# Altium schematic sheet Connectors and Mechanical.SchDoc: Connectors and Mechanical
size Letter; Date: 2019-01-27; DocumentNumber: 7; Revision: C; SheetNumber: 7; SheetTotal: 7; ProjectTitle: SDRdrum Arty Shield; PageSetup: Record=PageOptions|CenterHorizontal=True|CenterVertical=True|PrintScale=0.98|XCorrection=1.00|YCorrection=1.00|PrintKind=2|BorderSize=5000000|LeftOffset=0|BottomOffset=0|Orientation=2|PaperLength=1000|PaperWidth=1000|Scale=100|PaperSource=7|PrintQuality=-3|MediaType=1|DitherType=10|PrintScaleMode=1|PaperKind=Tabloid|PaperIndex=3
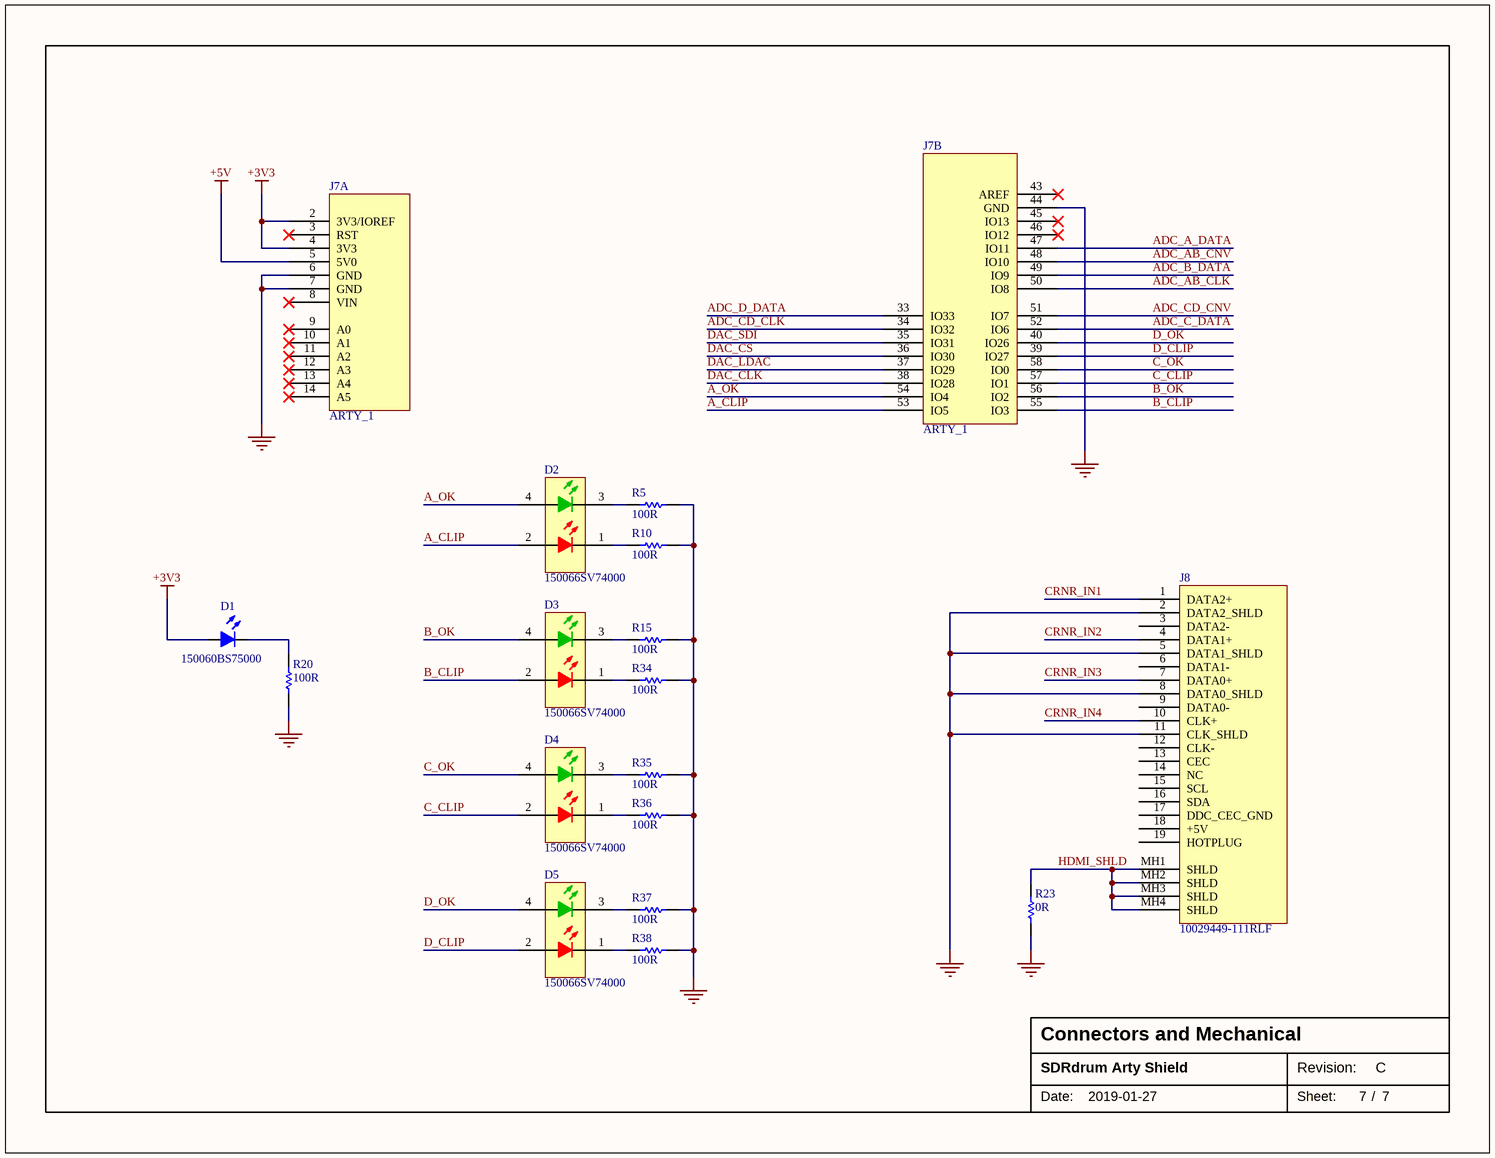
[diagram p0: Connectors and Mechanical.SchDoc]

## Parts
D1  150060BS75000  [WL-SMCW-0603-B]
D2  150066SV74000  [WL-SBCW-0606-GR]
D3  150066SV74000  [WL-SBCW-0606-GR]
D4  150066SV74000  [WL-SBCW-0606-GR]
D5  150066SV74000  [WL-SBCW-0606-GR]
J7  ARTY_1  [ARTY-TH_1]  (parts A,B of 2)
J8  10029449-111RLF  [10029449-111RLF]
R5  value 100R  [RES-0603-M]  (hidden comment: RES 100R 1% 1/10 W 0603 ±100ppm/°C)
R10  value 100R  [RES-0603-M]  (hidden comment: RES 100R 1% 1/10 W 0603 ±100ppm/°C)
R15  value 100R  [RES-0603-M]  (hidden comment: RES 100R 1% 1/10 W 0603 ±100ppm/°C)
R20  value 100R  [RES-0603-M]  (hidden comment: RES 100R 1% 1/10 W 0603 ±100ppm/°C)
R23  value 0R  [RES-0603-M]  (hidden comment: RES 0R Jumper 1/10 W 0603)
R34  value 100R  [RES-0603-M]  (hidden comment: RES 100R 1% 1/10 W 0603 ±100ppm/°C)
R35  value 100R  [RES-0603-M]  (hidden comment: RES 100R 1% 1/10 W 0603 ±100ppm/°C)
R36  value 100R  [RES-0603-M]  (hidden comment: RES 100R 1% 1/10 W 0603 ±100ppm/°C)
R37  value 100R  [RES-0603-M]  (hidden comment: RES 100R 1% 1/10 W 0603 ±100ppm/°C)
R38  value 100R  [RES-0603-M]  (hidden comment: RES 100R 1% 1/10 W 0603 ±100ppm/°C)

## Nets
+3V3: D1.2(A) J7.2(3V3/IOREF) J7.4(3V3)
+5V: J7.5(5V0)
GND: J7.6(GND) J7.7(GND) J7.44(GND) J8.2(DATA2_SHLD) J8.5(DATA1_SHLD) J8.8(DATA0_SHLD) J8.11(CLK_SHLD) R5.1 R10.1 R15.1 R20.1 R23.2 R34.1 R35.1 R36.1 R37.1 R38.1
A_CLIP: D2.2(A) J7.53(IO5)
A_OK: D2.4(A) J7.54(IO4)
ADC_A_DATA: J7.47(IO11)
ADC_AB_CLK: J7.50(IO8)
ADC_AB_CNV: J7.48(IO10)
ADC_B_DATA: J7.49(IO9)
ADC_C_DATA: J7.52(IO6)
ADC_CD_CLK: J7.34(IO32)
ADC_CD_CNV: J7.51(IO7)
ADC_D_DATA: J7.33(IO33)
B_CLIP: D3.2(A) J7.55(IO3)
B_OK: D3.4(A) J7.56(IO2)
C_CLIP: D4.2(A) J7.57(IO1)
C_OK: D4.4(A) J7.58(IO0)
CRNR_IN1: J8.1(DATA2+)
CRNR_IN2: J8.4(DATA1+)
CRNR_IN3: J8.7(DATA0+)
CRNR_IN4: J8.10(CLK+)
D_CLIP: D5.2(A) J7.39(IO27)
D_OK: D5.4(A) J7.40(IO26)
DAC_CLK: J7.38(IO28)
DAC_CS: J7.36(IO30)
DAC_LDAC: J7.37(IO29)
DAC_SDI: J7.35(IO31)
HDMI_SHLD: J8.MH1(SHLD) J8.MH2(SHLD) J8.MH3(SHLD) J8.MH4(SHLD) R23.1
NetD1_1: D1.1(K) R20.2
NetD2_1: D2.1(K) R10.2
NetD2_3: D2.3(K) R5.2
NetD3_1: D3.1(K) R34.2
NetD3_3: D3.3(K) R15.2
NetD4_1: D4.1(K) R36.2
NetD4_3: D4.3(K) R35.2
NetD5_1: D5.1(K) R38.2
NetD5_3: D5.3(K) R37.2

Not connected (* = marked no-connect by the designer): J7 3(RST)* 8(VIN)* 9(A0)* 10(A1)* 11(A2)* 12(A3)* 13(A4)* 14(A5)* 43(AREF)* 45(IO13)* 46(IO12)*; J8 3(DATA2-) 6(DATA1-) 9(DATA0-) 12(CLK-) 13(CEC) 14(NC) 15(SCL) 16(SDA) 17(DDC_CEC_GND) 18(+5V) 19(HOTPLUG)

## Notes on the sheet
- Date:
- Revision:
- Sheet:
- /

## Library data of the parts
D1 = 150060BS75000: LED, Blue (470 nm), 145 mcd, 20 mA, 0805; Supplier 1: Digi-Key; Supplier Part Number 1: 475-1410-1-ND
D2-D5 = 150066SV74000: LED, Green (570 nm)/Red (630 nm), Independent, 30 mcd/55 mcd, 20 mA, 0606
R5 R10 R15 R20 R34-R38 = RC0603FR-07100RL: Manufacturer: Yageo; Manufacturer Series: RC; Power: 1/10 W; Part Number: RC0603FR-07100RL; Component Type: Standard; Tolerance: 1%; Package: 0603; Temperature Coefficient: ±100ppm/°C; Temperature Range: -55°C ~ 155°C; Supplier 1: Digi-Key; Supplier Part Number 1: 311-100HRCT-ND
R23 = RC0603FR-070RL: Manufacturer: Yageo; Manufacturer Series: RC; Power: 1/10 W; Part Number: RC0603FR-070RL; Component Type: Standard; Tolerance: Jumper; Package: 0603; Temperature Range: -55°C ~ 155°C; Supplier 1: Digi-Key; Supplier Part Number 1: 311-0.0HRCT-ND